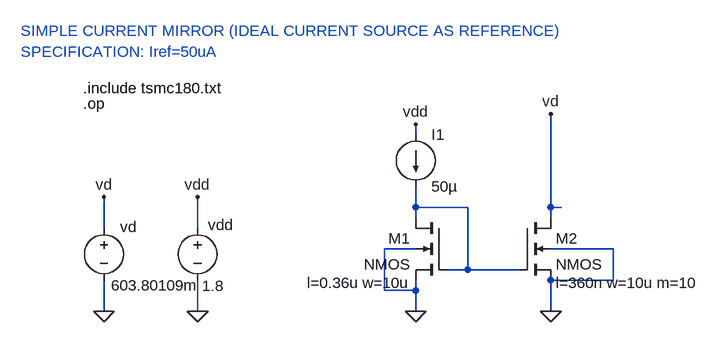
[diagram p0: schematic SimmpleCurrentMirror.asc]
SimmpleCurrentMirror.asc, the LTspice schematic file:
Version 4
SHEET 1 880 680
WIRE -16 -64 -16 -80
WIRE -16 48 -16 16
WIRE 64 48 -16 48
WIRE 192 48 192 -96
WIRE 208 48 192 48
WIRE -16 64 -16 48
WIRE 192 64 192 48
WIRE -496 80 -496 32
WIRE -352 80 -352 32
WIRE -16 112 -64 112
WIRE 288 112 192 112
WIRE 64 144 64 48
WIRE 64 144 32 144
WIRE 144 144 64 144
WIRE 288 160 288 112
WIRE 288 160 192 160
WIRE -64 176 -64 112
WIRE -16 176 -16 160
WIRE -16 176 -64 176
WIRE -496 208 -496 160
WIRE -352 208 -352 160
WIRE -16 208 -16 176
WIRE 192 208 192 160
FLAG -16 208 0
FLAG -352 208 0
FLAG -352 32 vdd
FLAG -16 -80 vdd
FLAG 192 208 0
FLAG -496 32 vd
FLAG -496 208 0
FLAG 192 -96 vd
SYMBOL nmos4 32 64 M0
WINDOW 123 56 100 Left 2
SYMATTR Value2 l=0.36u w=10u
SYMATTR InstName M1
SYMBOL voltage -352 64 R0
WINDOW 123 0 0 Left 0
WINDOW 39 0 0 Left 0
WINDOW 0 16 11 Left 2
WINDOW 3 7 105 Left 2
SYMATTR InstName vdd
SYMATTR Value 1.8
SYMBOL current -16 -64 R0
WINDOW 123 0 0 Left 0
WINDOW 39 0 0 Left 0
SYMATTR InstName I1
SYMATTR Value 50µ
SYMBOL nmos4 144 64 R0
WINDOW 123 56 100 Left 2
SYMATTR Value2 l=360n w=10u m=10
SYMATTR InstName M2
SYMBOL voltage -496 64 R0
WINDOW 0 25 14 Left 2
WINDOW 3 11 104 Left 2
WINDOW 123 0 0 Left 0
WINDOW 39 0 0 Left 0
SYMATTR InstName vd
SYMATTR Value 603.80109m
TEXT -528 -136 Left 2 !.include tsmc180.txt
TEXT -528 -112 Left 2 !.op
TEXT -624 -224 Left 2 ;SIMPLE CURRENT MIRROR (IDEAL CURRENT SOURCE AS REFERENCE)
TEXT -624 -192 Left 2 ;SPECIFICATION: Iref=50uA

The netlist it stands for:
* SimmpleCurrentMirror.asc
M1 N001 N001 0 0 NMOS l=0.36u w=10u
vdd vdd 0 1.8
I1 vdd N001 50µ
M2 vd N001 0 0 NMOS l=360n w=10u m=10
vd vd 0 603.80109m
.model NMOS NMOS
.model PMOS PMOS
.lib standard.mos
.include tsmc180.txt
.op
* SIMPLE CURRENT MIRROR (IDEAL CURRENT SOURCE AS REFERENCE)
* SPECIFICATION: Iref=50uA
.backanno
.end